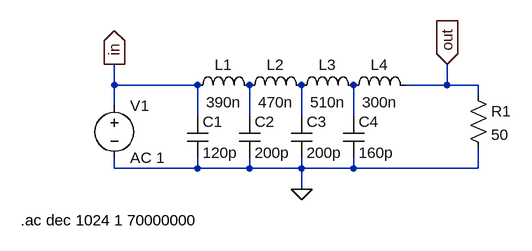
[diagram p0: schematic LPF30MHz.asc]
LPF30MHz.asc, the LTspice schematic file:
Version 4.1
SHEET 1 880 680
WIRE -48 96 -48 64
WIRE 80 96 -48 96
WIRE 464 96 464 64
WIRE 464 96 400 96
WIRE 512 96 464 96
WIRE 512 112 512 96
WIRE -48 128 -48 96
WIRE 80 144 80 96
WIRE 160 144 160 96
WIRE 240 144 240 96
WIRE 320 144 320 96
WIRE -48 224 -48 208
WIRE 80 224 80 208
WIRE 80 224 -48 224
WIRE 160 224 160 208
WIRE 160 224 80 224
WIRE 240 224 240 208
WIRE 240 224 160 224
WIRE 320 224 320 208
WIRE 320 224 240 224
WIRE 512 224 512 192
WIRE 512 224 320 224
WIRE 240 256 240 224
FLAG 240 256 0
FLAG -48 64 in
IOPIN -48 64 Out
FLAG 464 64 out
IOPIN 464 64 In
SYMBOL cap 64 144 R0
SYMATTR InstName C1
SYMATTR Value 120p
SYMBOL cap 144 144 R0
SYMATTR InstName C2
SYMATTR Value 200p
SYMBOL ind 64 112 R270
WINDOW 0 32 56 VTop 2
WINDOW 3 5 56 VBottom 2
SYMATTR InstName L1
SYMATTR Value 390n
SYMBOL ind 144 112 R270
WINDOW 0 32 56 VTop 2
WINDOW 3 5 56 VBottom 2
SYMATTR InstName L2
SYMATTR Value 470n
SYMBOL ind 224 112 R270
WINDOW 0 32 56 VTop 2
WINDOW 3 5 56 VBottom 2
SYMATTR InstName L3
SYMATTR Value 510n
SYMBOL voltage -48 112 R0
WINDOW 123 24 124 Left 2
WINDOW 39 0 0 Left 0
SYMATTR InstName V1
SYMATTR Value AC 1
SYMBOL res 496 96 R0
SYMATTR InstName R1
SYMATTR Value 50
SYMBOL cap 224 144 R0
SYMATTR InstName C3
SYMATTR Value 200p
SYMBOL cap 304 144 R0
SYMATTR InstName C4
SYMATTR Value 160p
SYMBOL ind 304 112 R270
WINDOW 0 32 56 VTop 2
WINDOW 3 5 56 VBottom 2
SYMATTR InstName L4
SYMATTR Value 300n
TEXT -192 304 Left 2 !.ac dec 1024 1 70000000

The netlist it stands for:
* LPF30MHz.asc
C1 in 0 120p
C2 N001 0 200p
L1 in N001 390n
L2 N001 N002 470n
L3 N002 N003 510n
V1 in 0 AC 1
R1 out 0 50
C3 N002 0 200p
C4 N003 0 160p
L4 N003 out 300n
.ac dec 1024 1 70000000
.backanno
.end